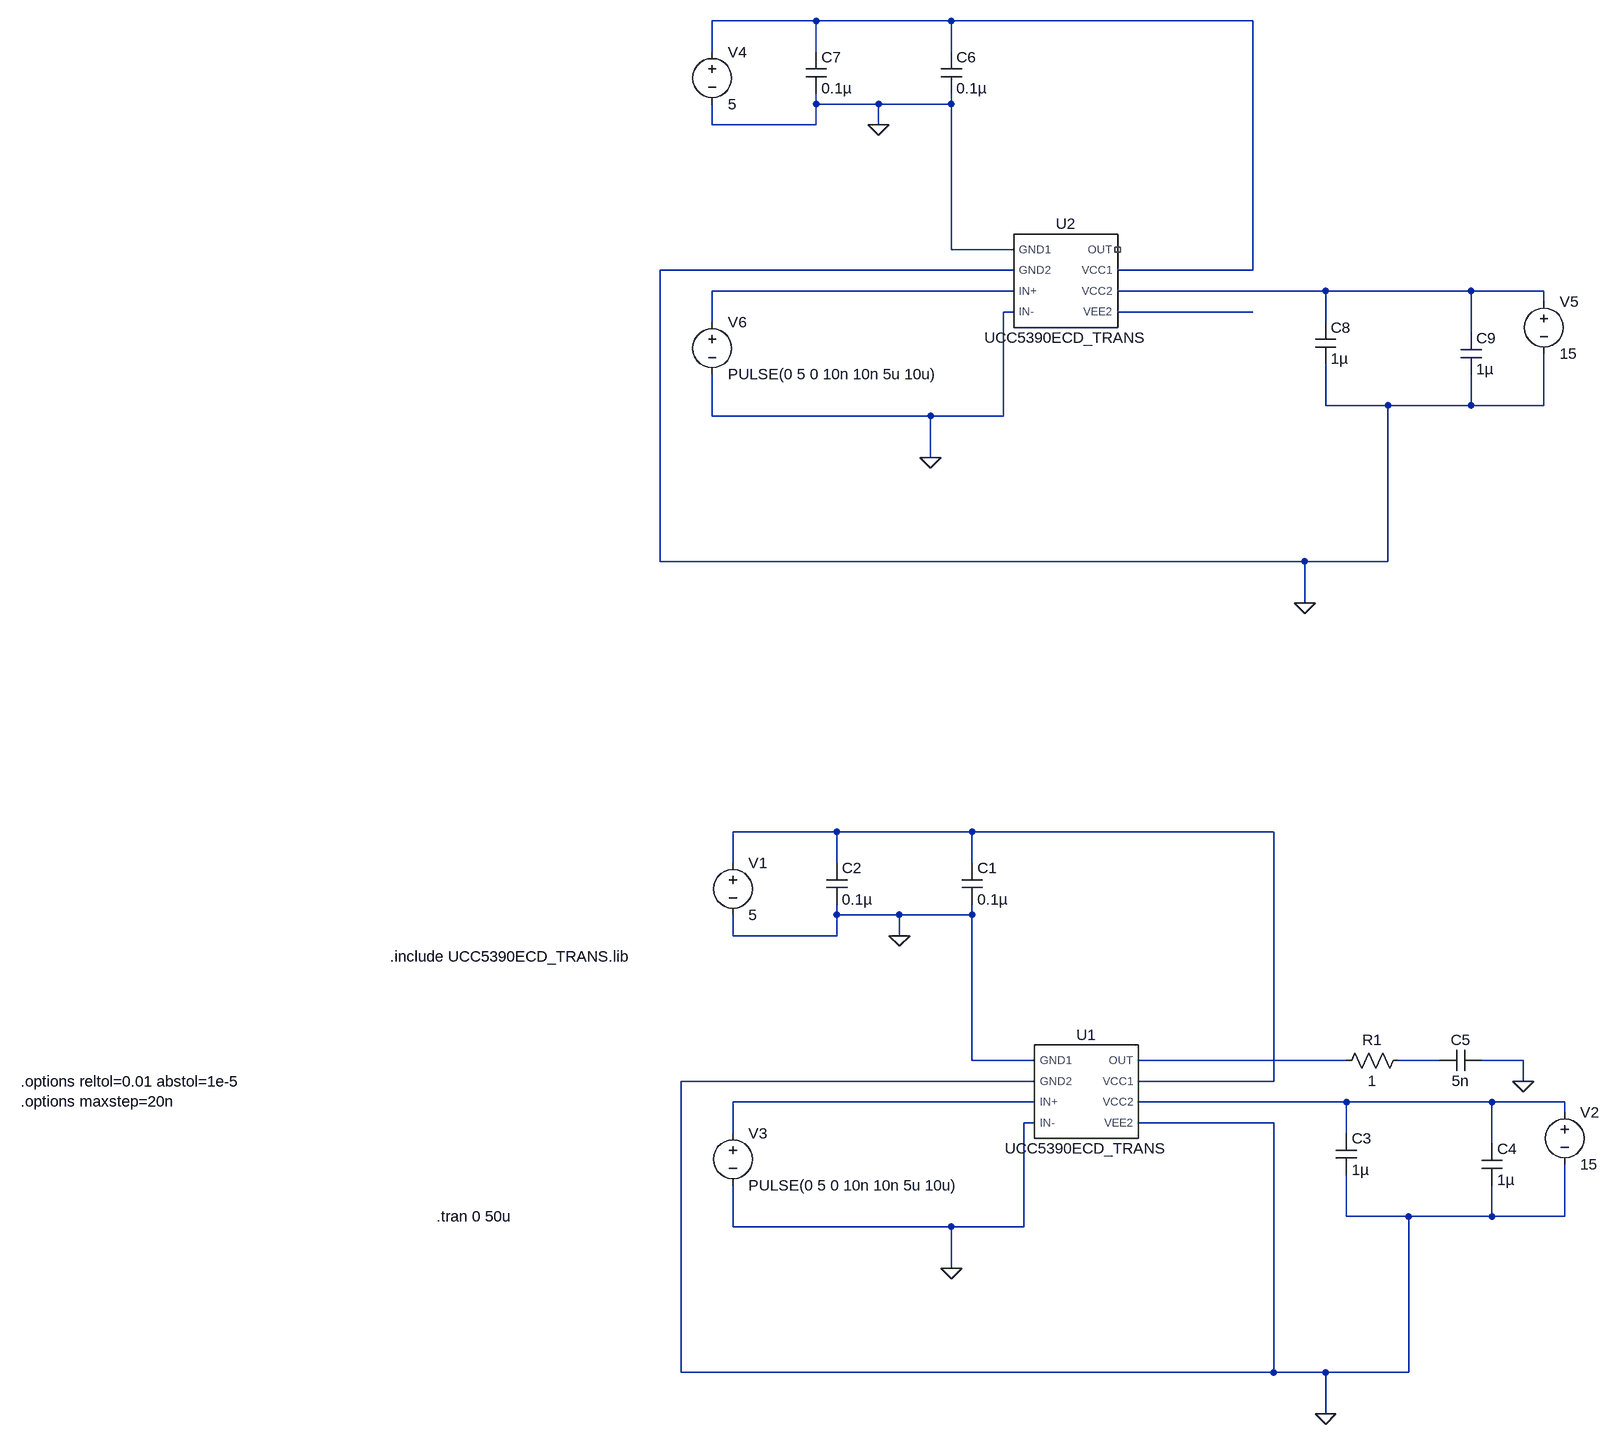
[diagram p0: schematic gate_driver_low.asc]
gate_driver_low.asc, the LTspice schematic file:
Version 4.1
SHEET 1 1736 760
WIRE 528 -1408 368 -1408
WIRE 736 -1408 528 -1408
WIRE 1200 -1408 736 -1408
WIRE 368 -1360 368 -1408
WIRE 528 -1360 528 -1408
WIRE 736 -1360 736 -1408
WIRE 528 -1280 528 -1296
WIRE 624 -1280 528 -1280
WIRE 736 -1280 736 -1296
WIRE 736 -1280 624 -1280
WIRE 368 -1248 368 -1280
WIRE 528 -1248 528 -1280
WIRE 528 -1248 368 -1248
WIRE 624 -1248 624 -1280
WIRE 736 -1056 736 -1280
WIRE 832 -1056 736 -1056
WIRE 832 -1024 288 -1024
WIRE 1200 -1024 1200 -1408
WIRE 1200 -1024 992 -1024
WIRE 832 -992 368 -992
WIRE 1312 -992 992 -992
WIRE 1536 -992 1312 -992
WIRE 1648 -992 1536 -992
WIRE 1648 -976 1648 -992
WIRE 832 -960 816 -960
WIRE 1200 -960 992 -960
WIRE 368 -944 368 -992
WIRE 1312 -944 1312 -992
WIRE 1536 -928 1536 -992
WIRE 1312 -816 1312 -880
WIRE 1408 -816 1312 -816
WIRE 1536 -816 1536 -864
WIRE 1536 -816 1408 -816
WIRE 1648 -816 1648 -896
WIRE 1648 -816 1536 -816
WIRE 368 -800 368 -864
WIRE 704 -800 368 -800
WIRE 816 -800 816 -960
WIRE 816 -800 704 -800
WIRE 704 -736 704 -800
WIRE 288 -576 288 -1024
WIRE 1280 -576 288 -576
WIRE 1408 -576 1408 -816
WIRE 1408 -576 1280 -576
WIRE 1280 -512 1280 -576
WIRE 560 -160 400 -160
WIRE 768 -160 560 -160
WIRE 1232 -160 768 -160
WIRE 400 -112 400 -160
WIRE 560 -112 560 -160
WIRE 768 -112 768 -160
WIRE 560 -32 560 -48
WIRE 656 -32 560 -32
WIRE 768 -32 768 -48
WIRE 768 -32 656 -32
WIRE 400 0 400 -32
WIRE 560 0 560 -32
WIRE 560 0 400 0
WIRE 656 0 656 -32
WIRE 768 192 768 -32
WIRE 864 192 768 192
WIRE 1344 192 1024 192
WIRE 1488 192 1424 192
WIRE 1616 192 1552 192
WIRE 864 224 320 224
WIRE 1232 224 1232 -160
WIRE 1232 224 1024 224
WIRE 1616 224 1616 192
WIRE 864 256 400 256
WIRE 1344 256 1024 256
WIRE 1568 256 1344 256
WIRE 1680 256 1568 256
WIRE 1680 272 1680 256
WIRE 864 288 848 288
WIRE 1232 288 1024 288
WIRE 400 304 400 256
WIRE 1344 304 1344 256
WIRE 1568 320 1568 256
WIRE 1344 432 1344 368
WIRE 1440 432 1344 432
WIRE 1568 432 1568 384
WIRE 1568 432 1440 432
WIRE 1680 432 1680 352
WIRE 1680 432 1568 432
WIRE 400 448 400 384
WIRE 736 448 400 448
WIRE 848 448 848 288
WIRE 848 448 736 448
WIRE 736 512 736 448
WIRE 320 672 320 224
WIRE 1232 672 1232 288
WIRE 1232 672 320 672
WIRE 1312 672 1232 672
WIRE 1440 672 1440 432
WIRE 1440 672 1312 672
WIRE 1312 736 1312 672
FLAG 656 0 0
FLAG 736 512 0
FLAG 1312 736 0
FLAG 1616 224 0
FLAG 624 -1248 0
FLAG 704 -736 0
FLAG 1280 -512 0
SYMBOL UCC5390ECD_TRANS 944 240 R0
SYMATTR InstName U1
SYMBOL voltage 400 -128 R0
WINDOW 123 0 0 Left 0
WINDOW 39 0 0 Left 0
SYMATTR InstName V1
SYMATTR Value 5
SYMBOL voltage 1680 256 R0
WINDOW 123 0 0 Left 0
WINDOW 39 0 0 Left 0
SYMATTR InstName V2
SYMATTR Value 15
SYMBOL voltage 400 288 R0
WINDOW 123 0 0 Left 0
WINDOW 39 0 0 Left 0
SYMATTR InstName V3
SYMATTR Value PULSE(0 5 0 10n 10n 5u 10u)
SYMBOL cap 752 -112 R0
SYMATTR InstName C1
SYMATTR Value 0.1µ
SYMBOL cap 544 -112 R0
SYMATTR InstName C2
SYMATTR Value 0.1µ
SYMBOL cap 1328 304 R0
SYMATTR InstName C3
SYMATTR Value 1µ
SYMBOL cap 1552 320 R0
SYMATTR InstName C4
SYMATTR Value 1µ
SYMBOL res 1440 176 R90
WINDOW 0 0 56 VBottom 2
WINDOW 3 32 56 VTop 2
SYMATTR InstName R1
SYMATTR Value 1
SYMBOL cap 1488 208 R270
WINDOW 0 32 32 VTop 2
WINDOW 3 0 32 VBottom 2
SYMATTR InstName C5
SYMATTR Value 5n
SYMBOL UCC5390ECD_TRANS 912 -1008 R0
SYMATTR InstName U2
SYMBOL voltage 368 -1376 R0
WINDOW 123 0 0 Left 0
WINDOW 39 0 0 Left 0
SYMATTR InstName V4
SYMATTR Value 5
SYMBOL voltage 1648 -992 R0
WINDOW 123 0 0 Left 0
WINDOW 39 0 0 Left 0
SYMATTR InstName V5
SYMATTR Value 15
SYMBOL voltage 368 -960 R0
WINDOW 123 0 0 Left 0
WINDOW 39 0 0 Left 0
SYMATTR InstName V6
SYMATTR Value PULSE(0 5 0 10n 10n 5u 10u)
SYMBOL cap 720 -1360 R0
SYMATTR InstName C6
SYMATTR Value 0.1µ
SYMBOL cap 512 -1360 R0
SYMATTR InstName C7
SYMATTR Value 0.1µ
SYMBOL cap 1296 -944 R0
SYMATTR InstName C8
SYMATTR Value 1µ
SYMBOL cap 1520 -928 R0
SYMATTR InstName C9
SYMATTR Value 1µ
TEXT -128 32 Left 2 !.include UCC5390ECD_TRANS.lib
TEXT -56 432 Left 2 !.tran 0 50u
TEXT -696 224 Left 2 !.options reltol=0.01 abstol=1e-5\n.options maxstep=20n

The netlist it stands for:
* gate_driver_low.asc
X§U1 0 0 N008 0 N006 N005 N009 0 UCC5390ECD_TRANS  ; pins GND1 GND2 IN+ IN- OUT VCC1 VCC2 VEE2
V1 N005 0 5
V2 N009 0 15
V3 N008 0 PULSE(0 5 0 10n 10n 5u 10u)
C1 N005 0 0.1µ
C2 N005 0 0.1µ
C3 N009 0 1µ
C4 N009 0 1µ
R1 N007 N006 1
C5 N007 0 5n
X§U2 0 0 N002 0 NC_01 N001 N003 N004 UCC5390ECD_TRANS  ; pins GND1 GND2 IN+ IN- OUT VCC1 VCC2 VEE2
V4 N001 0 5
V5 N003 0 15
V6 N002 0 PULSE(0 5 0 10n 10n 5u 10u)
C6 N001 0 0.1µ
C7 N001 0 0.1µ
C8 N003 0 1µ
C9 N003 0 1µ
.include UCC5390ECD_TRANS.lib
.tran 0 50u
.options reltol=0.01 abstol=1e-5
.options maxstep=20n
.lib UCC5390ECD_TRANS.LIB
.backanno
.end